# EAGLE schematic FAD8 (EAGLE 9.4.2)
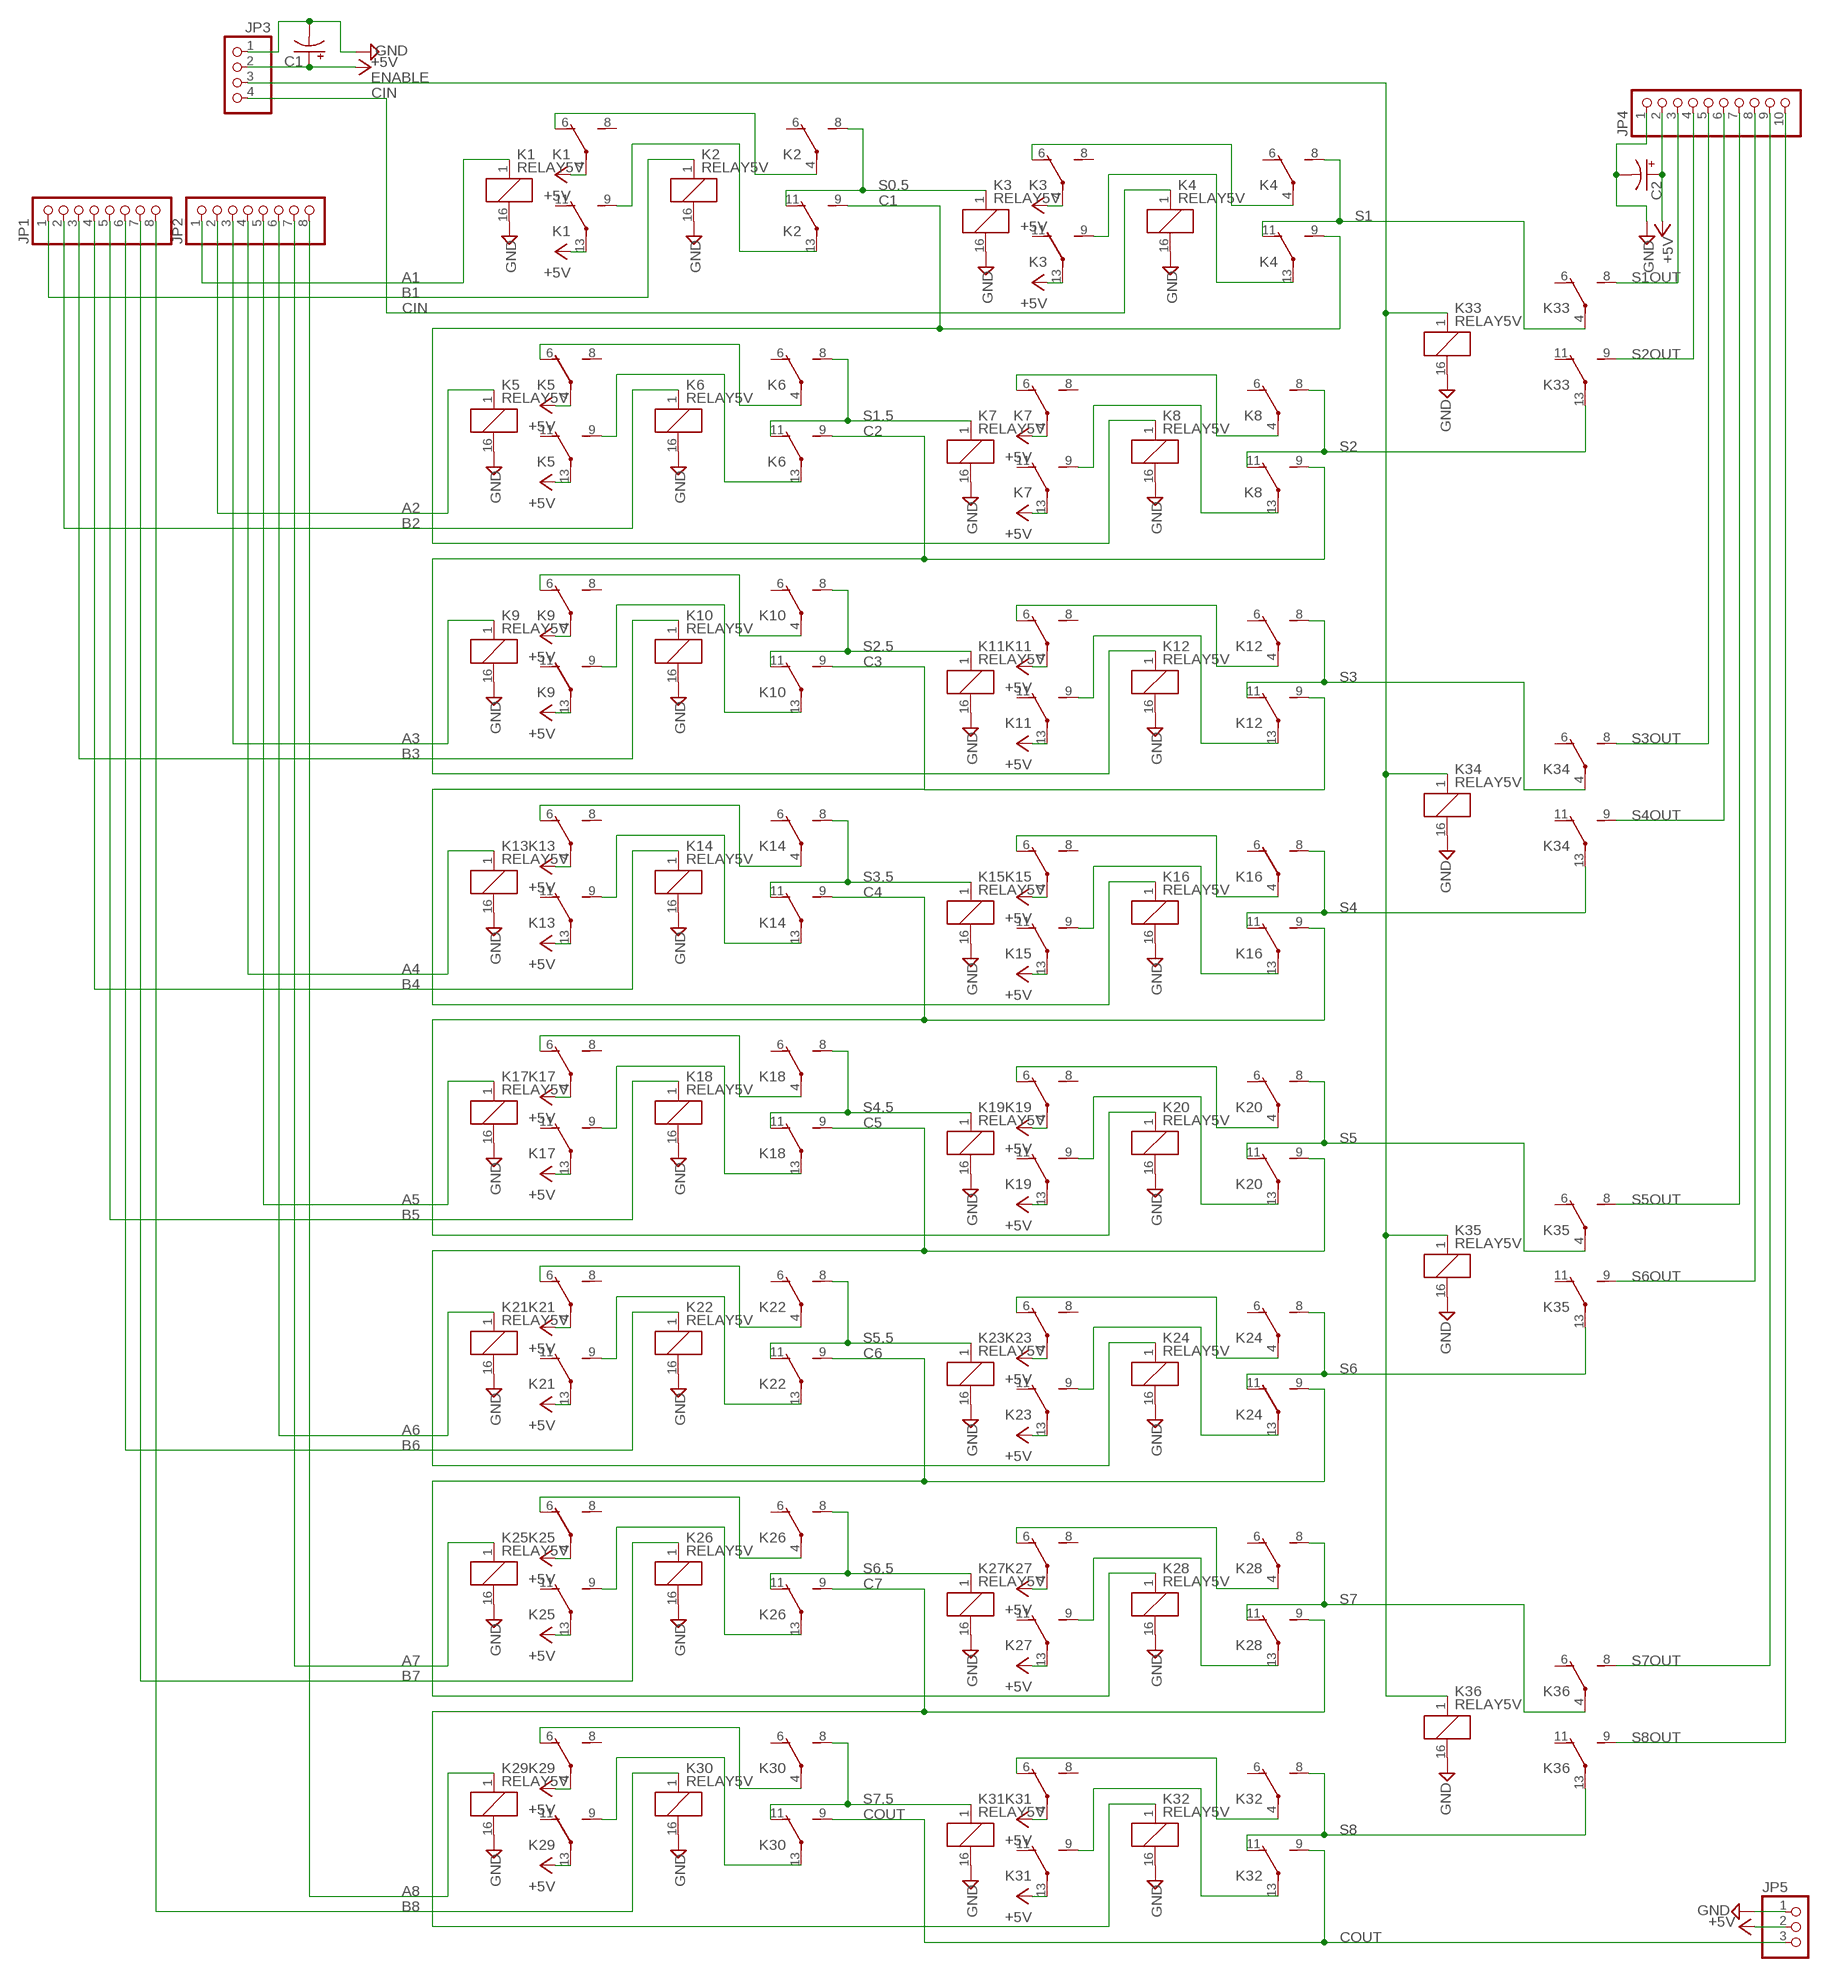
[diagram p0: schematic, sheet 1]

## Parts
C1  CC-5-8.5  [E5-8,5]
C2  CC-5-8.5  [E5-8,5]
JP1  PINHD-1X8  [1X08]
JP2  PINHD-1X8  [1X08]
JP3  PINHD-1X4  [1X04]
JP4  PINHD-1X10  [1X10]
JP5  PINHD-1X3  [1X03]
K1  RELAY5V  [DS-BT]
K2  RELAY5V  [DS-BT]
K3  RELAY5V  [DS-BT]
K4  RELAY5V  [DS-BT]
K5  RELAY5V  [DS-BT]
K6  RELAY5V  [DS-BT]
K7  RELAY5V  [DS-BT]
K8  RELAY5V  [DS-BT]
K9  RELAY5V  [DS-BT]
K10  RELAY5V  [DS-BT]
K11  RELAY5V  [DS-BT]
K12  RELAY5V  [DS-BT]
K13  RELAY5V  [DS-BT]
K14  RELAY5V  [DS-BT]
K15  RELAY5V  [DS-BT]
K16  RELAY5V  [DS-BT]
K17  RELAY5V  [DS-BT]
K18  RELAY5V  [DS-BT]
K19  RELAY5V  [DS-BT]
K20  RELAY5V  [DS-BT]
K21  RELAY5V  [DS-BT]
K22  RELAY5V  [DS-BT]
K23  RELAY5V  [DS-BT]
K24  RELAY5V  [DS-BT]
K25  RELAY5V  [DS-BT]
K26  RELAY5V  [DS-BT]
K27  RELAY5V  [DS-BT]
K28  RELAY5V  [DS-BT]
K29  RELAY5V  [DS-BT]
K30  RELAY5V  [DS-BT]
K31  RELAY5V  [DS-BT]
K32  RELAY5V  [DS-BT]
K33  RELAY5V  [DS-BT]
K34  RELAY5V  [DS-BT]
K35  RELAY5V  [DS-BT]
K36  RELAY5V  [DS-BT]

## Nets
+5V: C1.+ C2.+ JP3.2 JP4.2 JP5.2 K1.4(2:P) K1.13(3:P) K3.4(2:P) K3.13(3:P) K5.4(2:P) K5.13(3:P) K7.4(2:P) K7.13(3:P) K9.4(2:P) K9.13(3:P) K11.4(2:P) K11.13(3:P) K13.4(2:P) K13.13(3:P) K15.4(2:P) K15.13(3:P) K17.4(2:P) K17.13(3:P) K19.4(2:P) K19.13(3:P) K21.4(2:P) K21.13(3:P) K23.4(2:P) K23.13(3:P) K25.4(2:P) K25.13(3:P) K27.4(2:P) K27.13(3:P) K29.4(2:P) K29.13(3:P) K31.4(2:P) K31.13(3:P)
A1: JP2.1 K1.1(1:+)
A2: JP2.2 K5.1(1:+)
A3: JP2.3 K9.1(1:+)
A4: JP2.4 K13.1(1:+)
A5: JP2.5 K17.1(1:+)
A6: JP2.6 K21.1(1:+)
A7: JP2.7 K25.1(1:+)
A8: JP2.8 K29.1(1:+)
B1: JP1.1 K2.1(1:+)
B2: JP1.2 K6.1(1:+)
B3: JP1.3 K10.1(1:+)
B4: JP1.4 K14.1(1:+)
B5: JP1.5 K18.1(1:+)
B6: JP1.6 K22.1(1:+)
B7: JP1.7 K26.1(1:+)
B8: JP1.8 K30.1(1:+)
C1: K2.9(3:S) K4.9(3:S) K8.1(1:+)
C2: K6.9(3:S) K8.9(3:S) K12.1(1:+)
C3: K10.9(3:S) K12.9(3:S) K16.1(1:+)
C4: K14.9(3:S) K16.9(3:S) K20.1(1:+)
C5: K18.9(3:S) K20.9(3:S) K24.1(1:+)
C6: K22.9(3:S) K24.9(3:S) K28.1(1:+)
C7: K26.9(3:S) K28.9(3:S) K32.1(1:+)
CIN: JP3.4 K4.1(1:+)
COUT: JP5.3 K30.9(3:S) K32.9(3:S)
ENABLE: JP3.3 K33.1(1:+) K34.1(1:+) K35.1(1:+) K36.1(1:+)
GND: C1.- C2.- JP3.1 JP4.1 JP5.1 K1.16(1:-) K2.16(1:-) K3.16(1:-) K4.16(1:-) K5.16(1:-) K6.16(1:-) K7.16(1:-) K8.16(1:-) K9.16(1:-) K10.16(1:-) K11.16(1:-) K12.16(1:-) K13.16(1:-) K14.16(1:-) K15.16(1:-) K16.16(1:-) K17.16(1:-) K18.16(1:-) K19.16(1:-) K20.16(1:-) K21.16(1:-) K22.16(1:-) K23.16(1:-) K24.16(1:-) K25.16(1:-) K26.16(1:-) K27.16(1:-) K28.16(1:-) K29.16(1:-) K30.16(1:-) K31.16(1:-) K32.16(1:-) K33.16(1:-) K34.16(1:-) K35.16(1:-) K36.16(1:-)
N$1: K3.9(3:S) K4.13(3:P)
N$2: K1.9(3:S) K2.13(3:P)
N$3: K1.6(2:O) K2.4(2:P)
N$4: K3.6(2:O) K4.4(2:P)
N$5: K5.9(3:S) K6.13(3:P)
N$6: K5.6(2:O) K6.4(2:P)
N$7: K7.9(3:S) K8.13(3:P)
N$8: K7.6(2:O) K8.4(2:P)
N$9: K9.9(3:S) K10.13(3:P)
N$10: K9.6(2:O) K10.4(2:P)
N$11: K11.9(3:S) K12.13(3:P)
N$12: K11.6(2:O) K12.4(2:P)
N$13: K13.9(3:S) K14.13(3:P)
N$14: K13.6(2:O) K14.4(2:P)
N$15: K15.9(3:S) K16.13(3:P)
N$16: K15.6(2:O) K16.4(2:P)
N$17: K17.9(3:S) K18.13(3:P)
N$18: K17.6(2:O) K18.4(2:P)
N$19: K19.9(3:S) K20.13(3:P)
N$20: K19.6(2:O) K20.4(2:P)
N$21: K21.9(3:S) K22.13(3:P)
N$22: K21.6(2:O) K22.4(2:P)
N$23: K23.9(3:S) K24.13(3:P)
N$24: K23.6(2:O) K24.4(2:P)
N$25: K25.9(3:S) K26.13(3:P)
N$26: K25.6(2:O) K26.4(2:P)
N$27: K27.9(3:S) K28.13(3:P)
N$28: K27.6(2:O) K28.4(2:P)
N$29: K29.9(3:S) K30.13(3:P)
N$30: K29.6(2:O) K30.4(2:P)
N$31: K31.9(3:S) K32.13(3:P)
N$32: K31.6(2:O) K32.4(2:P)
S0.5: K2.8(2:S) K2.11(3:O) K3.1(1:+)
S1: K4.8(2:S) K4.11(3:O) K33.4(2:P)
S1.5: K6.8(2:S) K6.11(3:O) K7.1(1:+)
S1OUT: JP4.3 K33.8(2:S)
S2: K8.8(2:S) K8.11(3:O) K33.13(3:P)
S2.5: K10.8(2:S) K10.11(3:O) K11.1(1:+)
S2OUT: JP4.4 K33.9(3:S)
S3: K12.8(2:S) K12.11(3:O) K34.4(2:P)
S3.5: K14.8(2:S) K14.11(3:O) K15.1(1:+)
S3OUT: JP4.5 K34.8(2:S)
S4: K16.8(2:S) K16.11(3:O) K34.13(3:P)
S4.5: K18.8(2:S) K18.11(3:O) K19.1(1:+)
S4OUT: JP4.6 K34.9(3:S)
S5: K20.8(2:S) K20.11(3:O) K35.4(2:P)
S5.5: K22.8(2:S) K22.11(3:O) K23.1(1:+)
S5OUT: JP4.7 K35.8(2:S)
S6: K24.8(2:S) K24.11(3:O) K35.13(3:P)
S6.5: K26.8(2:S) K26.11(3:O) K27.1(1:+)
S6OUT: JP4.8 K35.9(3:S)
S7: K28.8(2:S) K28.11(3:O) K36.4(2:P)
S7.5: K30.8(2:S) K30.11(3:O) K31.1(1:+)
S7OUT: JP4.9 K36.8(2:S)
S8: K32.8(2:S) K32.11(3:O) K36.13(3:P)
S8OUT: JP4.10 K36.9(3:S)
Unconnected: K1.8(2:S) K1.11(3:O) K2.6(2:O) K3.8(2:S) K3.11(3:O) K4.6(2:O) K5.8(2:S) K5.11(3:O) K6.6(2:O) K7.8(2:S) K7.11(3:O) K8.6(2:O) K9.8(2:S) K9.11(3:O) K10.6(2:O) K11.8(2:S) K11.11(3:O) K12.6(2:O) K13.8(2:S) K13.11(3:O) K14.6(2:O) K15.8(2:S) K15.11(3:O) K16.6(2:O) K17.8(2:S) K17.11(3:O) K18.6(2:O) K19.8(2:S) K19.11(3:O) K20.6(2:O) K21.8(2:S) K21.11(3:O) K22.6(2:O) K23.8(2:S) K23.11(3:O) K24.6(2:O) K25.8(2:S) K25.11(3:O) K26.6(2:O) K27.8(2:S) K27.11(3:O) K28.6(2:O) K29.8(2:S) K29.11(3:O) K30.6(2:O) K31.8(2:S) K31.11(3:O) K32.6(2:O) K33.6(2:O) K33.11(3:O) K34.6(2:O) K34.11(3:O) K35.6(2:O) K35.11(3:O) K36.6(2:O) K36.11(3:O)

## Library data of the parts
C1 C2 = Passive_Robotech:CC
JP1 JP2 = pinhead:PINHD-1X8: PIN HEADER
JP3 = pinhead:PINHD-1X4: PIN HEADER
JP4 = pinhead:PINHD-1X10: PIN HEADER
JP5 = pinhead:PINHD-1X3: PIN HEADER
K1-K36 = My:RELAY: DS-BT RELAYS 4,000 V BREAKDOWN VOLTAGE NAiS Source: http://www.mew-europe.com/.. en_ds_61005_0010.pdf

## Net classes
0 default: width 0.813 mm